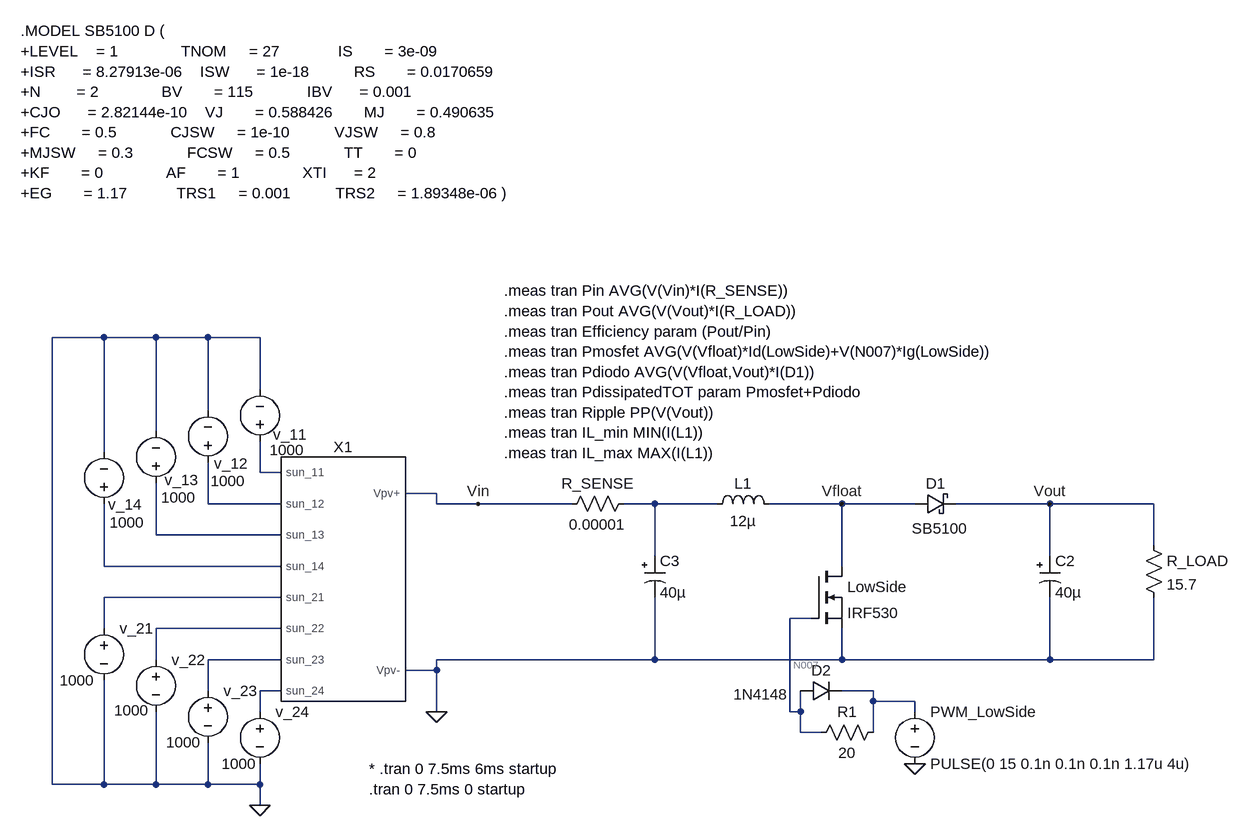
[diagram p0: schematic mppt_async_rev2.asc]
mppt_async_rev2.asc, the LTspice schematic file:
Version 4
SHEET 1 880 1684
WIRE -3792 496 -3872 496
WIRE -3712 496 -3792 496
WIRE -3632 496 -3712 496
WIRE -3552 496 -3632 496
WIRE -3552 576 -3552 496
WIRE -3632 608 -3632 496
WIRE -3712 640 -3712 496
WIRE -3792 672 -3792 496
WIRE -3552 704 -3552 656
WIRE -3520 704 -3552 704
WIRE -3280 736 -3328 736
WIRE -3632 752 -3632 688
WIRE -3520 752 -3632 752
WIRE -3280 752 -3280 736
WIRE -3216 752 -3280 752
WIRE -3072 752 -3216 752
WIRE -2944 752 -2992 752
WIRE -2848 752 -2944 752
WIRE -2656 752 -2768 752
WIRE -2544 752 -2656 752
WIRE -2336 752 -2480 752
WIRE -2176 752 -2336 752
WIRE -3712 800 -3712 720
WIRE -3520 800 -3712 800
WIRE -2176 816 -2176 752
WIRE -2944 832 -2944 752
WIRE -2336 832 -2336 752
WIRE -3792 848 -3792 752
WIRE -3520 848 -3792 848
WIRE -2656 848 -2656 752
WIRE -3520 896 -3792 896
WIRE -2704 928 -2736 928
WIRE -3792 944 -3792 896
WIRE -3520 944 -3712 944
WIRE -3712 992 -3712 944
WIRE -3520 992 -3632 992
WIRE -2944 992 -2944 896
WIRE -2944 992 -3280 992
WIRE -2656 992 -2656 944
WIRE -2656 992 -2944 992
WIRE -2336 992 -2336 896
WIRE -2336 992 -2656 992
WIRE -2176 992 -2176 896
WIRE -2176 992 -2336 992
WIRE -3280 1008 -3280 992
WIRE -3280 1008 -3328 1008
WIRE -3632 1040 -3632 992
WIRE -3520 1040 -3552 1040
WIRE -2608 1040 -2656 1040
WIRE -2608 1056 -2608 1040
WIRE -2544 1056 -2608 1056
WIRE -3552 1072 -3552 1040
WIRE -3280 1072 -3280 1008
WIRE -2736 1072 -2736 928
WIRE -2720 1072 -2720 1040
WIRE -2720 1072 -2736 1072
WIRE -2544 1072 -2544 1056
WIRE -2720 1104 -2720 1072
WIRE -2688 1104 -2720 1104
WIRE -2608 1104 -2608 1056
WIRE -3872 1184 -3872 496
WIRE -3792 1184 -3792 1024
WIRE -3792 1184 -3872 1184
WIRE -3712 1184 -3712 1072
WIRE -3712 1184 -3792 1184
WIRE -3632 1184 -3632 1120
WIRE -3632 1184 -3712 1184
WIRE -3552 1184 -3552 1152
WIRE -3552 1184 -3632 1184
WIRE -3552 1216 -3552 1184
FLAG -2544 1152 0
FLAG -3552 1216 0
FLAG -3280 1072 0
FLAG -2656 752 Vfloat
FLAG -2336 752 Vout
FLAG -3216 752 Vin
SYMBOL ind -2864 768 R270
WINDOW 0 32 56 VTop 2
WINDOW 3 5 56 VBottom 2
SYMATTR InstName L1
SYMATTR Value 12µ
SYMBOL nmos -2704 848 R0
SYMATTR InstName LowSide
SYMATTR Value IRF530
SYMBOL polcap -2352 832 R0
WINDOW 3 24 56 Left 2
SYMATTR Value 40µ
SYMATTR InstName C2
SYMATTR Description Capacitor
SYMATTR Type cap
SYMATTR SpiceLine Lser=0
SYMBOL voltage -2544 1056 R0
WINDOW 123 0 0 Left 0
WINDOW 39 0 0 Left 0
SYMATTR InstName PWM_LowSide
SYMATTR Value PULSE(0 15 0.1n 0.1n 0.1n 1.17u 4u)
SYMBOL pannello_40Celle_v1 -3424 816 R0
SYMATTR InstName X1
SYMBOL voltage -3552 1056 R0
WINDOW 3 -59 96 Left 2
WINDOW 123 0 0 Left 0
WINDOW 39 0 0 Left 0
SYMATTR Value 1000
SYMATTR InstName v_24
SYMBOL voltage -3632 1024 R0
WINDOW 3 -64 95 Left 2
WINDOW 123 0 0 Left 0
WINDOW 39 0 0 Left 0
SYMATTR Value 1000
SYMATTR InstName v_23
SYMBOL voltage -3712 976 R0
WINDOW 3 -64 94 Left 2
WINDOW 123 0 0 Left 0
WINDOW 39 0 0 Left 0
SYMATTR Value 1000
SYMATTR InstName v_22
SYMBOL voltage -3792 928 R0
WINDOW 3 -68 96 Left 2
WINDOW 123 0 0 Left 0
WINDOW 39 0 0 Left 0
SYMATTR Value 1000
SYMATTR InstName v_21
SYMBOL voltage -3552 672 R180
WINDOW 0 -73 27 Left 2
WINDOW 3 -69 3 Left 2
WINDOW 123 0 0 Left 0
WINDOW 39 0 0 Left 0
SYMATTR InstName v_11
SYMATTR Value 1000
SYMBOL voltage -3632 704 R180
WINDOW 0 -62 14 Left 2
WINDOW 3 -58 -13 Left 2
WINDOW 123 0 0 Left 0
WINDOW 39 0 0 Left 0
SYMATTR InstName v_12
SYMATTR Value 1000
SYMBOL voltage -3712 736 R180
WINDOW 0 -66 21 Left 2
WINDOW 3 -62 -6 Left 2
WINDOW 123 0 0 Left 0
WINDOW 39 0 0 Left 0
SYMATTR InstName v_13
SYMATTR Value 1000
SYMBOL voltage -3792 768 R180
WINDOW 0 -59 15 Left 2
WINDOW 3 -63 -13 Left 2
WINDOW 123 0 0 Left 0
WINDOW 39 0 0 Left 0
SYMATTR InstName v_14
SYMATTR Value 1000
SYMBOL schottky -2544 768 R270
WINDOW 0 32 32 VTop 2
WINDOW 3 -6 38 VBottom 2
SYMATTR InstName D1
SYMATTR Value SB5100
SYMATTR Description Diode
SYMATTR Type diode
SYMBOL res -3088 768 R270
WINDOW 0 32 56 VTop 2
WINDOW 3 0 56 VBottom 2
SYMATTR InstName R_SENSE
SYMATTR Value 0.00001
SYMBOL polcap -2960 832 R0
WINDOW 3 24 56 Left 2
SYMATTR Value 40µ
SYMATTR InstName C3
SYMATTR Description Capacitor
SYMATTR Type cap
SYMATTR SpiceLine Lser=0
SYMBOL diode -2720 1056 R270
WINDOW 0 32 32 VTop 2
WINDOW 3 26 -61 VBottom 2
SYMATTR InstName D2
SYMATTR Value 1N4148
SYMBOL res -2592 1088 R90
WINDOW 0 0 56 VBottom 2
WINDOW 3 32 56 VTop 2
SYMATTR InstName R1
SYMATTR Value 20
SYMBOL res -2192 800 R0
SYMATTR InstName R_LOAD
SYMATTR Value 15.7
TEXT -3384 1160 Left 2 !* .tran 0 7.5ms 6ms startup\n.tran 0 7.5ms 0 startup
TEXT -3920 24 Left 2 !.MODEL SB5100 D (\n+LEVEL    = 1              TNOM     = 27             IS       = 3e-09          \n+ISR      = 8.27913e-06    ISW      = 1e-18          RS       = 0.0170659      \n+N        = 2              BV       = 115            IBV      = 0.001          \n+CJO      = 2.82144e-10    VJ       = 0.588426       MJ       = 0.490635       \n+FC       = 0.5            CJSW     = 1e-10          VJSW     = 0.8            \n+MJSW     = 0.3            FCSW     = 0.5            TT       = 0              \n+KF       = 0              AF       = 1              XTI      = 2              \n+EG       = 1.17           TRS1     = 0.001          TRS2     = 1.89348e-06 )
TEXT -3176 424 Left 2 !.meas tran Pin AVG(V(Vin)*I(R_SENSE))\n.meas tran Pout AVG(V(Vout)*I(R_LOAD))\n.meas tran Efficiency param (Pout/Pin)\n.meas tran Pmosfet AVG(V(Vfloat)*Id(LowSide)+V(N007)*Ig(LowSide))\n.meas tran Pdiodo AVG(V(Vfloat,Vout)*I(D1))\n.meas tran PdissipatedTOT param Pmosfet+Pdiodo\n.meas tran Ripple PP(V(Vout))\n.meas tran IL_min MIN(I(L1))\n.meas tran IL_max MAX(I(L1))

The netlist it stands for:
* mppt_async_rev2.asc
L1 N003 Vfloat 12µ
M§LowSide Vfloat N007 0 0 IRF530
C2 Vout 0 40µ Lser=0
V§PWM_LowSide N011 0 PULSE(0 15 0.1n 0.1n 0.1n 1.17u 4u)
XX1 N001 N002 N004 N005 N006 N008 N009 N010 Vin 0 pannello_40Celle_v1  ; pins sun_11 sun_12 sun_13 sun_14 sun_21 sun_22 sun_23 sun_24 Vpv+ Vpv-
v_24 N010 0 1000
v_23 N009 0 1000
v_22 N008 0 1000
v_21 N006 0 1000
v_11 N001 0 1000
v_12 N002 0 1000
v_13 N004 0 1000
v_14 N005 0 1000
D1 Vfloat Vout SB5100
R_SENSE Vin N003 0.00001
C3 N003 0 40µ Lser=0
D2 N007 N011 1N4148
R1 N011 N007 20
R_LOAD Vout 0 15.7
.model D D
.lib standard.dio
.model NMOS NMOS
.model PMOS PMOS
.lib standard.mos
* .tran 0 7.5ms 6ms startup
.tran 0 7.5ms 0 startup
.MODEL SB5100 D (
+LEVEL    = 1              TNOM     = 27             IS       = 3e-09
+ISR      = 8.27913e-06    ISW      = 1e-18          RS       = 0.0170659
+N        = 2              BV       = 115            IBV      = 0.001
+CJO      = 2.82144e-10    VJ       = 0.588426       MJ       = 0.490635
+FC       = 0.5            CJSW     = 1e-10          VJSW     = 0.8
+MJSW     = 0.3            FCSW     = 0.5            TT       = 0
+KF       = 0              AF       = 1              XTI      = 2
+EG       = 1.17           TRS1     = 0.001          TRS2     = 1.89348e-06 )
.meas tran Pin AVG(V(Vin)*I(R_SENSE))
.meas tran Pout AVG(V(Vout)*I(R_LOAD))
.meas tran Efficiency param (Pout/Pin)
.meas tran Pmosfet AVG(V(Vfloat)*Id(LowSide)+V(N007)*Ig(LowSide))
.meas tran Pdiodo AVG(V(Vfloat,Vout)*I(D1))
.meas tran PdissipatedTOT param Pmosfet+Pdiodo
.meas tran Ripple PP(V(Vout))
.meas tran IL_min MIN(I(L1))
.meas tran IL_max MAX(I(L1))
.backanno
.end